# Altium schematic sheet 4_MISC.SchDoc: SHMP_MainBoard - Misc
size B; Author: Sébastien Gélinas; Organization: SmartHalo; Address1: 5445 de Gaspé; Address2: Montréal, QC; Address3: Canada; Address4: H2T 3B2; Revision: 1; SheetNumber: 4; SheetTotal: 4
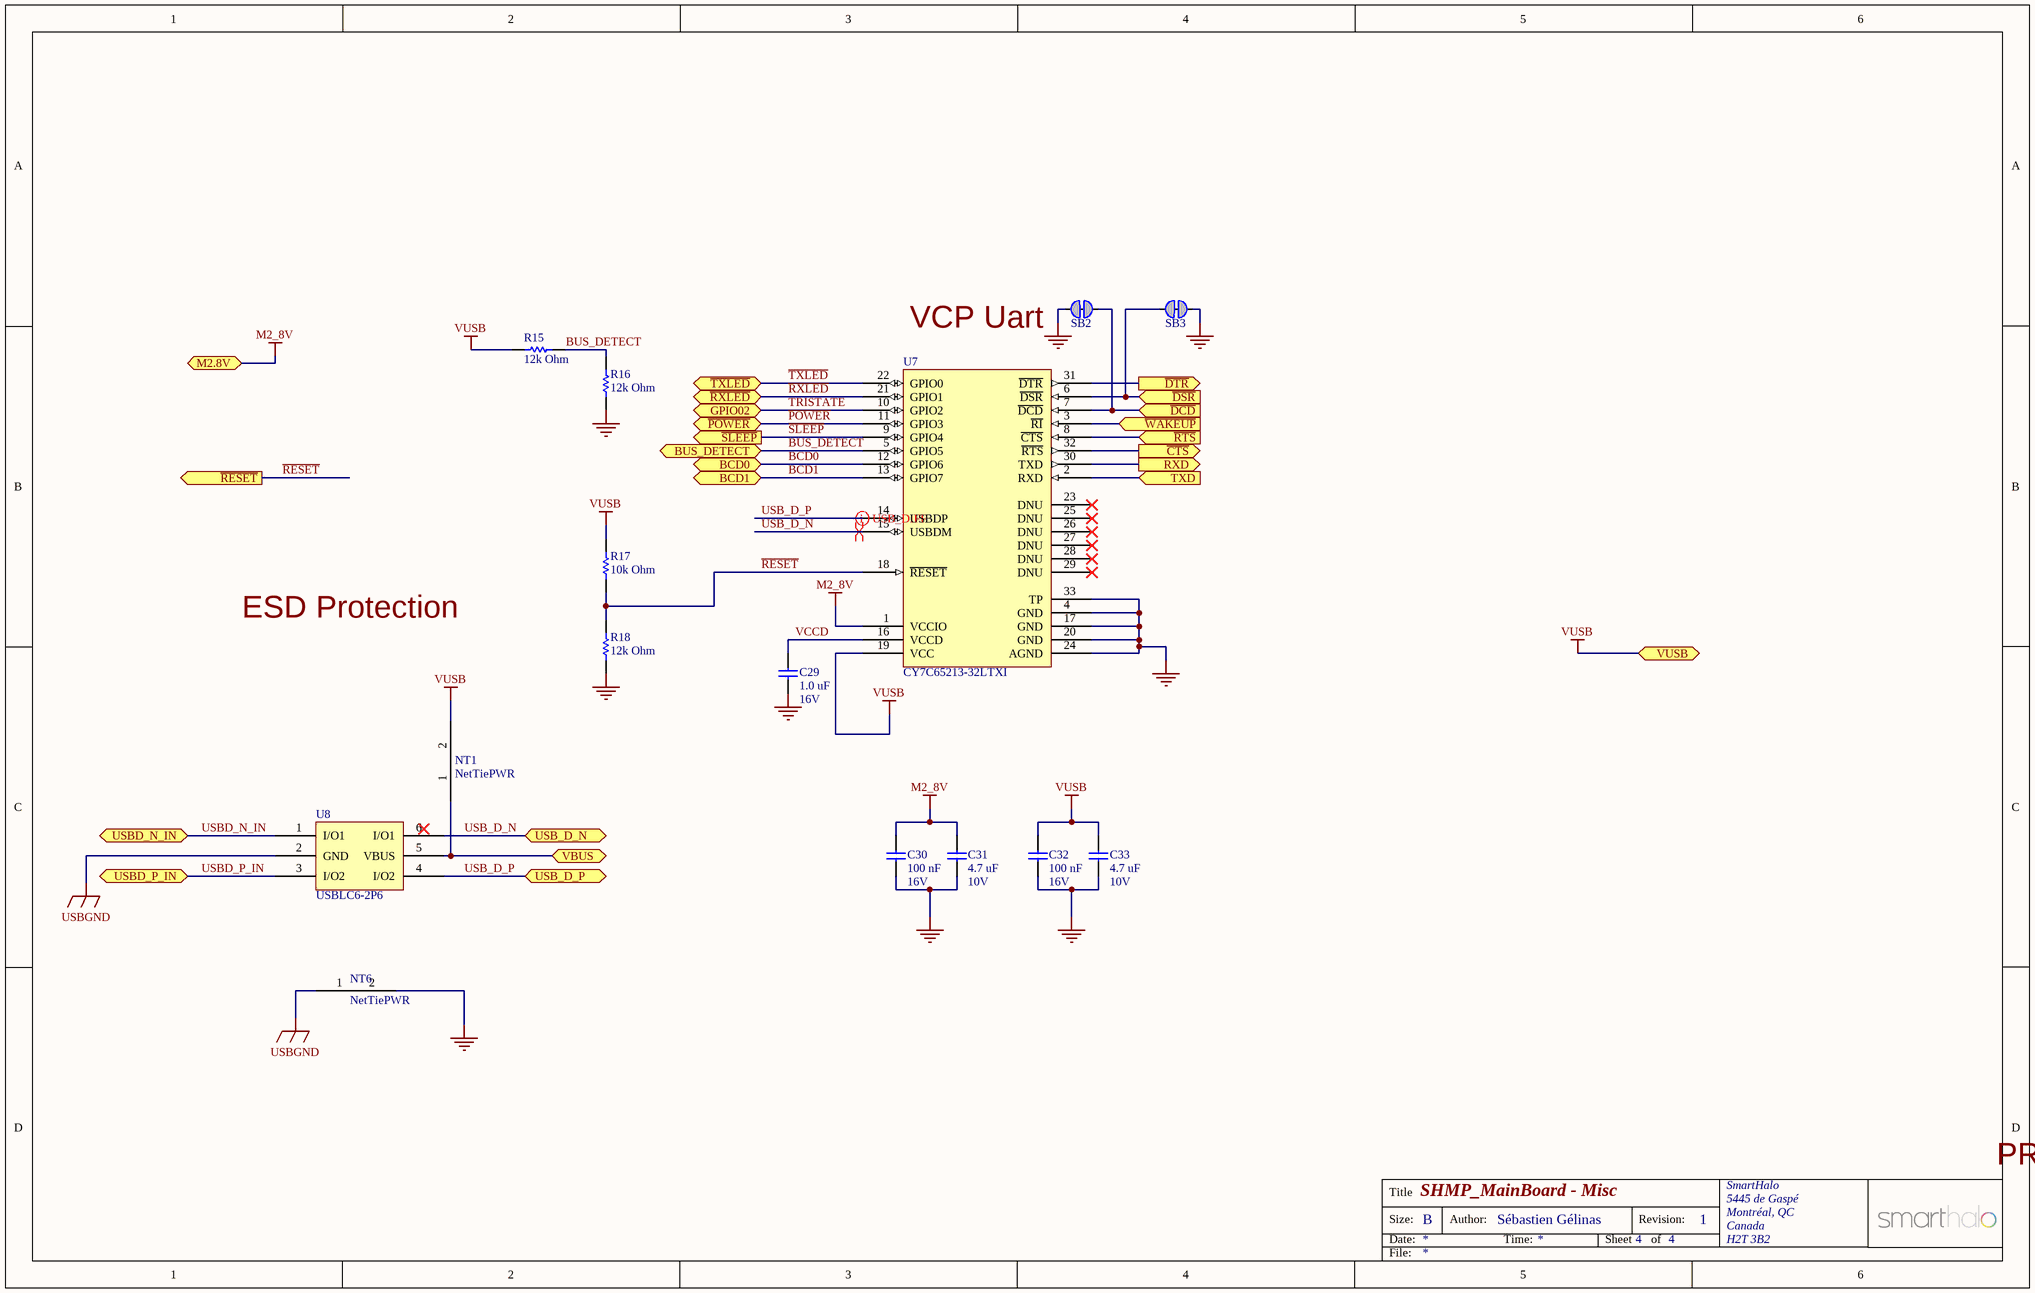
[diagram p0: 4_MISC.SchDoc]

## Parts
C29  1.0 uF  Voltage Rating: 16V  [Varitron_CAP0603]
C30  100 nF  Voltage Rating: 16V  [Varitron_CAP0402]
C31  4.7 uF  Voltage Rating: 10V  [Varitron_CAP0603]
C32  100 nF  Voltage Rating: 16V  [Varitron_CAP0402]
C33  4.7 uF  Voltage Rating: 10V  [Varitron_CAP0603]
NT1  NetTiePWR  [NetTiePWR]  (net tie, no BOM)
NT6  NetTiePWR  [NetTiePWR]  (net tie, no BOM)
R15  12k Ohm  [Varitron_RES0402]
R16  12k Ohm  [Varitron_RES0402]
R17  10k Ohm  [Varitron_RES0402]
R18  12k Ohm  [Varitron_RES0402]
SB2  Solderbridge  [Solderbridge_Shorted]  (value not drawn)  (net tie, no BOM)
SB3  Solderbridge  [Solderbridge_Shorted]  (value not drawn)  (net tie, no BOM)
U7  CY7C65213-32LTXI  [QFN-32-TP]
U8  USBLC6-2P6  [ST-SOT666]

## Ports
BCD0, BCD1, BUS_DETECT, GPIO02, M2.8V, RXD (out), TXD (in), USB_D_N (bidir), USB_D_P (bidir), USBD_N_IN (bidir), USBD_P_IN (bidir), VBUS, VUSB, ~{CTS} (out), ~{DCD} (in), ~{DSR} (in), ~{DTR} (out), ~{POWER}, ~{RESET} (out), ~{RTS} (in), ~{RXLED}, ~{SLEEP} (out), ~{TXLED}, ~{WAKEUP} (in)

## Nets
GND: C29.2 C30.2 C31.2 C32.2 C33.2 NT6.2(NET2) R16.2 R18.1 SB2.1 SB3.1 U7.4(GND) U7.17(GND) U7.20(GND) U7.24(AGND) U7.33(TP)
M2_8V: C30.1 C31.1 U7.1(VCCIO) ; port M2.8V
USBGND: NT6.1(NET1) U8.2(GND)
VUSB: C32.1 C33.1 NT1.2(NET2) R15.2 R17.2 U7.19(VCC) ; port VUSB
BCD0: U7.12(GPIO6) ; port BCD0
BCD1: U7.13(GPIO7) ; port BCD1
BUS_DETECT: R15.1 R16.1 U7.5(GPIO5) ; port BUS_DETECT
~{CTS}: U7.32(~{RTS}) ; port ~{CTS}
~{DCD}: SB2.2 U7.7(~{DCD}) ; port ~{DCD}
~{DSR}: SB3.2 U7.6(~{DSR}) ; port ~{DSR}
~{DTR}: U7.31(~{DTR}) ; port ~{DTR}
~{POWER}: U7.11(GPIO3) ; port ~{POWER}
~{RESET}: R17.1 R18.2 U7.18(~{RESET}) ; port ~{RESET}
~{RTS}: U7.8(~{CTS}) ; port ~{RTS}
~{RXLED}: U7.21(GPIO1) ; port ~{RXLED}
RXD: U7.30(TXD) ; port RXD
~{SLEEP}: U7.9(GPIO4) ; port ~{SLEEP}
~{TXLED}: U7.22(GPIO0) ; port ~{TXLED}
TRISTATE: U7.10(GPIO2) ; port GPIO02
TXD: U7.2(RXD) ; port TXD
USB_D_N: U7.15(USBDM) U8.6(I/O1) ; port USB_D_N
USB_D_P: U7.14(USBDP) U8.4(I/O2) ; port USB_D_P
USBD_N_IN: U8.1(I/O1) ; port USBD_N_IN
USBD_P_IN: U8.3(I/O2) ; port USBD_P_IN
VBUS: NT1.1(NET1) U8.5(VBUS) ; port VBUS
VCCD: C29.1 U7.16(VCCD)
~{WAKEUP}: U7.3(~{RI}) ; port ~{WAKEUP}

Not connected (* = marked no-connect by the designer): U7 23(DNU)* 25(DNU)* 26(DNU)* 27(DNU)* 28(DNU)* 29(DNU)*

## Layout directives
differential pair: USB_D_N, USB_D_P

## Notes on the sheet
- VCP Uart
- ESD Protection
- PRELIMINARY: DO NOT USE FOR PRODUCTION
- Title
- Size:
- Date:
- B
- Author:
- Time:
- Sheet
- Revision:
- of
- File:

## Library data of the parts
C29 = Varitron_CAP0603: 1.0 uF 16V X7R 10% 0603 (1608 Metric)  SMD; Case-EIA: 0603; Case-Metric: 1608; Tolerance: 10%; Technology: SMT; Temperature Coefficient: X7R; Value: 1.0 uF; Supplier: Arrow Electronics; Footprint Name: 0603
C30 C32 = Varitron_CAP0402: 100 nF 16V X7R 10% 0402 (1005 Metric)  SMD; Case-EIA: 0402; Case-Metric: 1005; Tolerance: 10%; Technology: SMT; Temperature Coefficient: X7R; Value: 100 nF; Supplier: Arrow Electronics; Footprint Name: 0402
C31 C33 = Varitron_CAP0603: 4.7 uF 10V X7R 10% 0603 (1608 Metric)  SMD; Case-EIA: 0603; Case-Metric: 1608; Tolerance: 10%; Technology: SMT; Temperature Coefficient: X7R; Value: 4.7 uF; Supplier: Arrow Electronics; Footprint Name: 0603
R15 R16 R18 = Varitron_RES0402: 12k 0.063W 5%  0402 (1005 Metric)  SMD; Case-Metric: 1005; Case-EIA: 0402; Tolerance: 5%; Technology: SMT; Power: 0.063W; Value: 12k Ohm; Supplier: Arrow Electronics; Footprint Name: 0402
R17 = Varitron_RES0402: 10k 0.063W 5%  0402 (1005 Metric)  SMD; Case-Metric: 1005; Case-EIA: 0402; Tolerance: 5%; Technology: SMT; Power: 0.063W; Value: 10k Ohm; Supplier: Arrow Electronics; Footprint Name: 0402
SB2 SB3 = SOLDERBRIDGE_SHORTED: Shorted Solderbridge; Value: Solderbridge
U7 = CY7C65213-32LTXI: IC USB TO UART BRIDGE 32QFN; Manufacturer: Cypress; Manufacturer Part Number: CY7C65213-32LTXI; Part Number: CY7C65213-32LTXI; Supplier: Arrow Electronics; Footprint Name: QFN32TP
U8 = USBLC6-2P6: Very low capacitance ESD protection; Manufacturer: STMicroelectronics; Manufacturer Part Number: USBLC6-2P6; Part Number: USBLC6-2P6; Supplier: Arrow Electronics; Footprint Name: SOT666